# EAGLE schematic parrot_v1 (EAGLE 9.4.1)
CNAME: Parrot Teensy Board; CREVISION: 1.0; DESIGNER: Nathan Villicana-Shaw
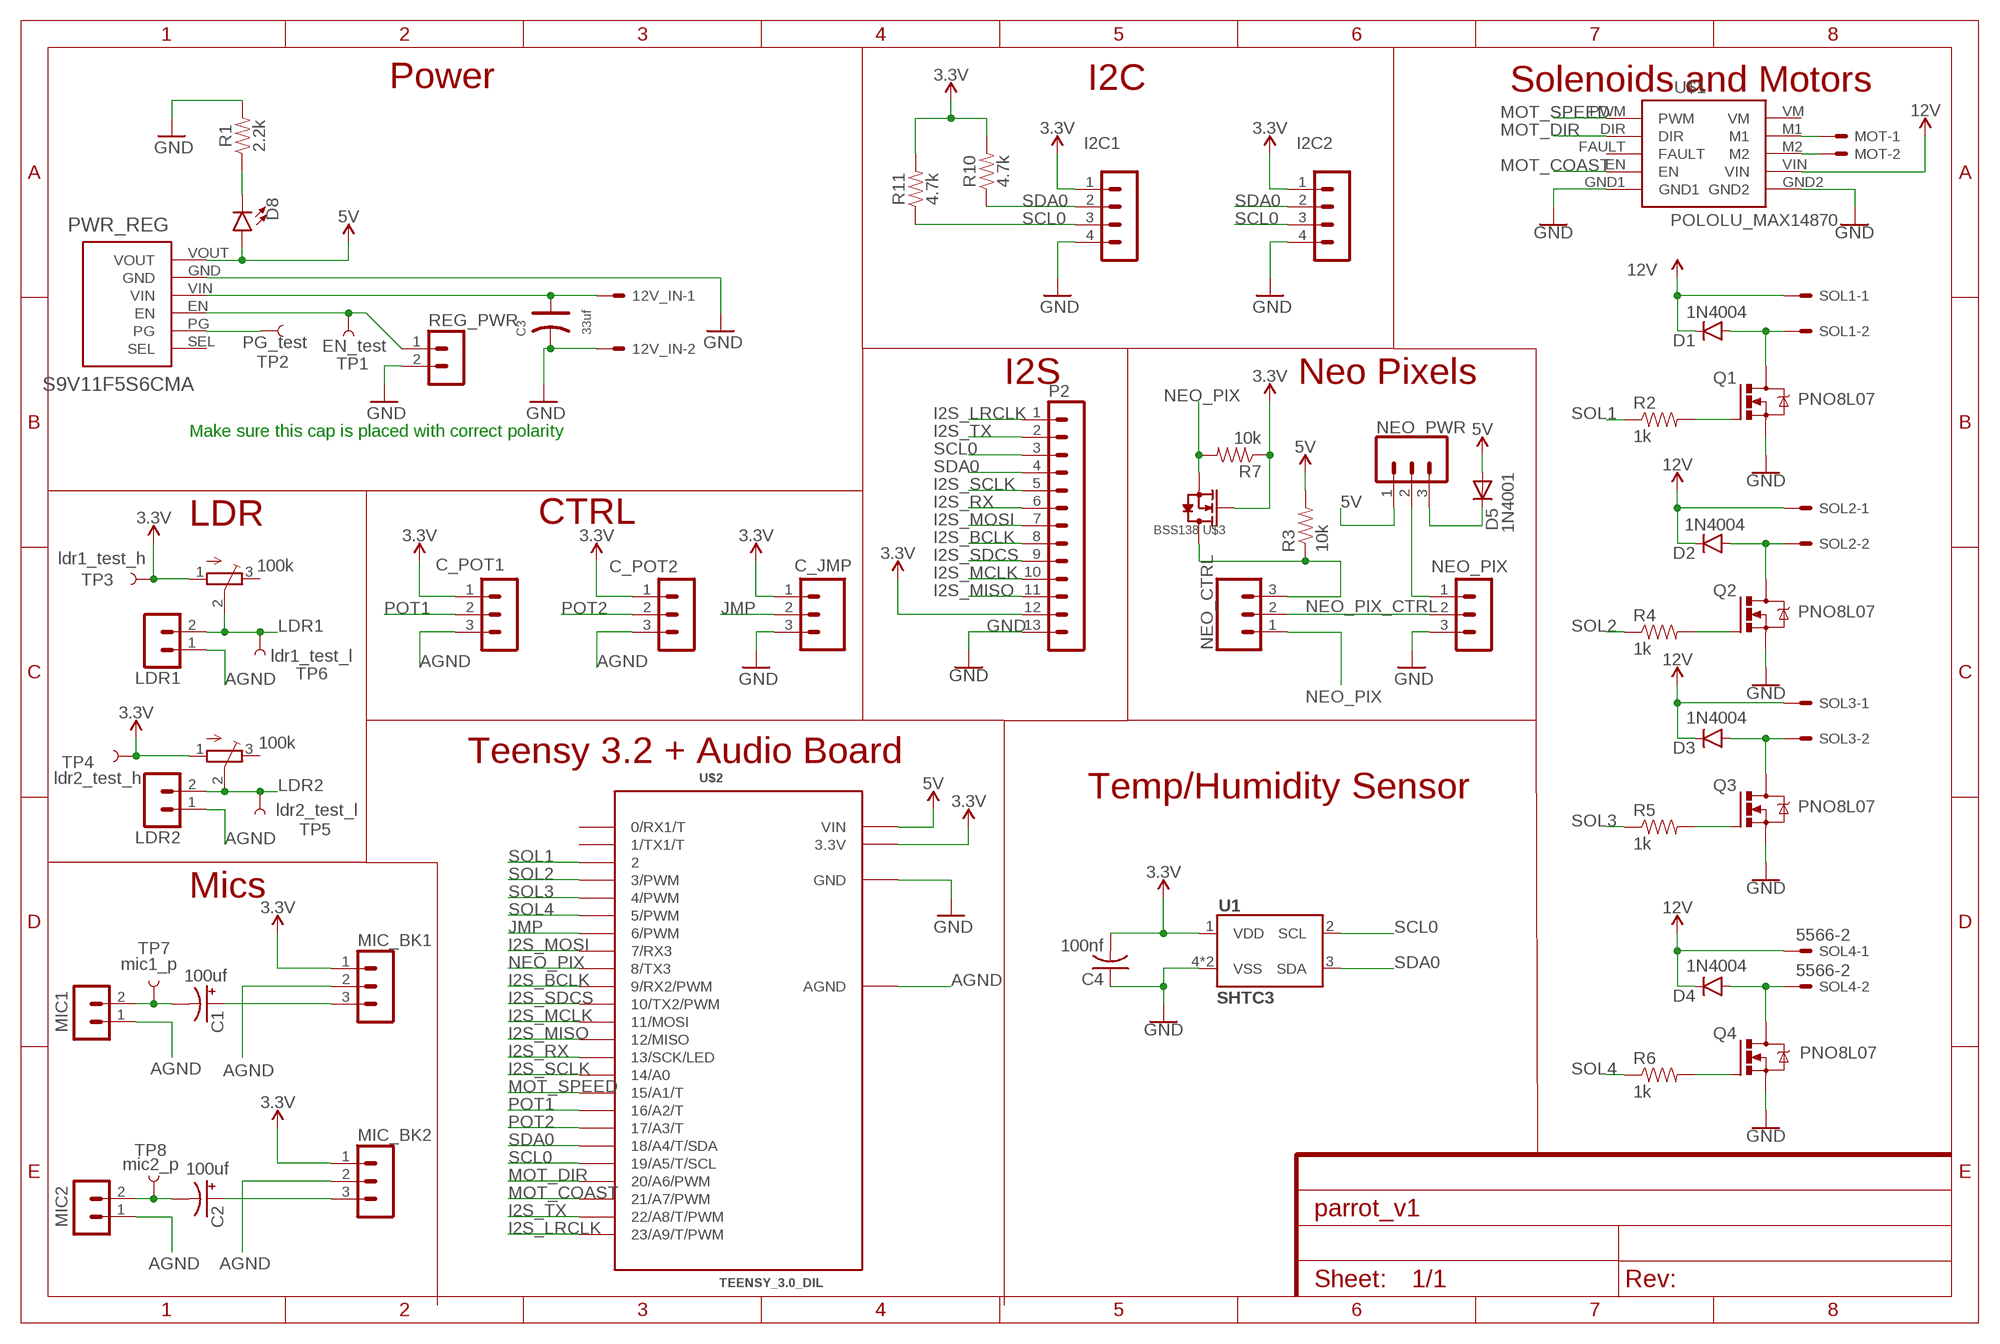
[diagram p0: schematic, sheet 1]

## Parts
12V_IN  5566-2  [5566-2]
C1  100uf  1000UF-RADIAL-5MM-25V-20%  [CPOL-RADIAL-5MM-10MM]
C2  100uf  1000UF-RADIAL-5MM-25V-20%  [CPOL-RADIAL-5MM-10MM]
C3  33uf  DIP-ALUMINUM-47UF-16V(D5-H7MM)  [PC-D5.3MM]
C4  100nf  C-USC2012  [C2012]
C_JMP  CONN_03  [1X03]
C_POT1  B3B-PH-K  [B3B-PH-K]
C_POT2  B3B-PH-K  [B3B-PH-K]
D1  1N4004  DIODEPTH  [DIODE-1N4001]
D2  1N4004  DIODEPTH  [DIODE-1N4001]
D3  1N4004  DIODEPTH  [DIODE-1N4001]
D4  1N4004  DIODEPTH  [DIODE-1N4001]
D5  1N4001  1N4004  [DO41-10]
D8  LED-FKIT-1206  [FKIT-LED-1206]
I2C1  B4B-PH-K  [B4B-PH-K]
I2C2  B4B-PH-K  [B4B-PH-K]
LDR1  B2B-PH-K  [B2B-PH-K]
LDR2  B2B-PH-K  [B2B-PH-K]
MIC1  B2B-PH-K  [B2B-PH-K]
MIC2  B2B-PH-K  [B2B-PH-K]
MIC_BK1  B3B-PH-K  [B3B-PH-K]
MIC_BK2  B3B-PH-K  [B3B-PH-K]
MOT  5566-2  [5566-2]
NEO_CTRL  CONN_03  [1X03]
NEO_PIX  B3B-PH-K  [B3B-PH-K]
NEO_PWR  CONN_03  [1X03]
P2  B13B-PH-K  [B13B-PH-K]
PWR_REG  S9V11F5S6CMA  [S9V11F3S5CMA]
Q1  PNO8L07  IRF540  [TO220BV]
Q2  PNO8L07  IRF540  [TO220BV]
Q3  PNO8L07  IRF540  [TO220BV]
Q4  PNO8L07  IRF540  [TO220BV]
R1  2.2k  2.2OHM-0603-1/10W-5%  [0603]
R2  1k  10KOHM-HORIZ-1/4W-5%  [AXIAL-0.3]
R3  10k  10KOHM-HORIZ-1/4W-5%  [AXIAL-0.3]
R4  1k  10KOHM-HORIZ-1/4W-5%  [AXIAL-0.3]
R5  1k  10KOHM-HORIZ-1/4W-5%  [AXIAL-0.3]
R6  1k  10KOHM-HORIZ-1/4W-5%  [AXIAL-0.3]
R7  10k  10KOHM-HORIZ-1/4W-5%  [AXIAL-0.3]
R10  4.7k  10OHM-HORIZ-1/4W-1%  [AXIAL-0.3]
R11  4.7k  10OHM-HORIZ-1/4W-1%  [AXIAL-0.3]
REG_PWR  B2B-PH-K  [B2B-PH-K]
SOL1  5566-2  [5566-2]
SOL2  5566-2  [5566-2]
SOL3  5566-2  [5566-2]
SOL4  5566-2  [5566-2]
TM1  100k  TRIMPOTTC33X  [TC33X]
TM2  100k  TRIMPOTTC33X  [TC33X]
TP1  EN_test  TEST-POINTTP_15TH_THRU  [TP_15TH]
TP2  PG_test  TEST-POINTTP_15TH_THRU  [TP_15TH]
TP3  ldr1_test_h  TEST-POINTTP_15TH_THRU  [TP_15TH]
TP4  ldr2_test_h  TEST-POINTTP_15TH_THRU  [TP_15TH]
TP5  ldr2_test_l  TEST-POINTTP_15TH_THRU  [TP_15TH]
TP6  ldr1_test_l  TEST-POINTTP_15TH_THRU  [TP_15TH]
TP7  mic1_p  TEST-POINTTP_15TH_THRU  [TP_15TH]
TP8  mic2_p  TEST-POINTTP_15TH_THRU  [TP_15TH]
U1  SHTC3  [SHTC3]
U$1  POLOLU_MAX14870  [POLOLU_MAX14870]
U$2  TEENSY_3.0_DIL  [TEENSY_3.0-3.2&LC_DIL]
U$3  BSS138  [SOT23-3]

## Nets
3.3V [3.3V]: C4.2 C_JMP.1 C_POT1.1 C_POT2.1 I2C1.1 I2C2.1 MIC_BK1.1 MIC_BK2.1 P2.12 R7.P$1 R10.P$2 R11.P$2 TM1.1(A) TM2.1(A) TP3.P$1 TP4.P$1 U1.1(VDD) U$2.3.3V U$3.1(G)
5V: D5.A D8.A NEO_PWR.1 PWR_REG.VOUT R3.P$2 U$2.VIN
12V [12V_IN]: 12V_IN.1 C3.+ D1.C D2.C D3.C D4.C PWR_REG.VIN SOL1.1 SOL2.1 SOL3.1 SOL4.1 U$1.VIN
AGND: C_POT1.3 C_POT2.3 LDR1.1 LDR2.1 MIC1.1 MIC2.1 MIC_BK1.2 MIC_BK2.2 U$2.AGND
GND: 12V_IN.2 C3.- C4.1 C_JMP.3 I2C1.4 I2C2.4 NEO_PIX.3 P2.13 PWR_REG.GND Q1.S Q2.S Q3.S Q4.S R1.2 REG_PWR.2 U1.4(VSS) U1.5(VSS) U$1.GND2 U$2.GND
I2S_BCLK: P2.8 U$2.9(9/RX2/PWM)
I2S_LRCLK: P2.1 U$2.23/A9(23/A9/T/PWM)
I2S_MCLK: P2.10 U$2.11(11/MOSI)
I2S_MISO: P2.11 U$2.12(12/MISO)
I2S_MOSI: P2.7 U$2.7(7/RX3)
I2S_RX: P2.6 U$2.13(13/SCK/LED)
I2S_SCLK: P2.5 U$2.14/A0
I2S_SDCS: P2.9 U$2.10(10/TX2/PWM)
I2S_TX: P2.2 U$2.22/A8(22/A8/T/PWM)
JMP: C_JMP.2 U$2.6(6/PWM)
LDR1: LDR1.2 TM1.2(S) TP6.P$1
LDR2: LDR2.2 TM2.2(S) TP5.P$1
MOT_COAST: U$1.EN U$2.21/A7(21/A7/PWM)
MOT_DIR: U$1.DIR U$2.20/A6(20/A6/PWM)
MOT_SPEED: U$1.PWM U$2.15/A1(15/A1/T)
N$1: D8.C R1.1
N$2: C1.- MIC1.2 TP7.P$1
N$3: PWR_REG.PG TP2.P$1
N$4: C2.+ MIC_BK2.3
N$5: Q2.G R4.P$2
N$6: C1.+ MIC_BK1.3
N$7: C2.- MIC2.2 TP8.P$1
N$8: D2.A Q2.D SOL2.2
N$9 [3.3V]: NEO_PIX.1 NEO_PWR.2
N$10: PWR_REG.EN REG_PWR.1 TP1.P$1
N$11: Q3.G R5.P$2
N$12: D3.A Q3.D SOL3.2
N$13: Q4.G R6.P$2
N$14: D4.A Q4.D SOL4.2
N$15: U$1.GND1 ; supply symbol labelled GND
N$16: D5.C NEO_PWR.3
N$17: NEO_CTRL.3 R3.P$1 U$3.3(D)
N$24: Q1.G R2.P$2
N$25: D1.A Q1.D SOL1.2
N$30: MOT.2 U$1.M2
N$31: MOT.1 U$1.M1
NEO_PIX: NEO_CTRL.1 R7.P$2 U$2.8(8/TX3) U$3.2(S)
NEO_PIX_CTRL: NEO_CTRL.2 NEO_PIX.2
POT1: C_POT1.2 U$2.16/A2(16/A2/T)
POT2: C_POT2.2 U$2.17/A3(17/A3/T)
SCL0: I2C1.3 I2C2.3 P2.3 R11.P$1 U1.2(SCL) U$2.19/A5(19/A5/T/SCL)
SDA0: I2C1.2 I2C2.2 P2.4 R10.P$1 U1.3(SDA) U$2.18/A4(18/A4/T/SDA)
SOL1: R2.P$1 U$2.2
SOL2: R4.P$1 U$2.3(3/PWM)
SOL3: R5.P$1 U$2.4(4/PWM)
SOL4: R6.P$1 U$2.5(5/PWM)
Unconnected: PWR_REG.SEL TM1.3(E) TM2.3(E) U$1.FAULT U$1.VM U$2.0(0/RX1/T) U$2.1(1/TX1/T)

## Notes on the sheet
- Solenoids and Motors
- Power | I2C
- I2S | Neo Pixels
- Make sure this cap is placed with correct polarity
- LDR | CTRL
- Teensy 3.2 + Audio Board
- Temp/Humidity Sensor
- Mics

## Library data of the parts
12V_IN MOT SOL1-SOL4 = con-molex:5566-2: Mini FIT connector 2 pol Source: http://www.molex.com; MF: MOLEX; OC_FARNELL: 1822072; OC_NEWARK: unknown
C1 C2 = SparkFun-Capacitors:1000UF: 1,000µF/1mF ceramic capacitors A capacitor is a passive two-terminal electrical component used to store electrical energy temporarily in an electric field. CAP-08070; PROD_ID: CAP-09538; VALUE: 1mF
C3 = Seeed-Capacitor:DIP-ALUMINUM-47UF-16V(D5-H7MM): 302030033; MPN: KS 100uF/16V; VALUE: 100uf
C4 = adafruit:C-US: CAPACITOR, American symbol
C_JMP NEO_CTRL NEO_PWR = SparkFun-Connectors:CONN_03: Multi connection point. Often used as Generic Header-pin footprint for 0.1 inch spaced/style header connections On any of the 0.1 inch spaced packages, you can populate with these: Break Away Headers - Straight <https://www.sparkfun.com/products/116> (PRT-00116) Break Away Male Headers - Right Angle <https://www.sparkfun.com/products/553> (PRT-00553) Female Headers <https://www.sparkfun.com/products/115> (PRT-00115) Break Away Headers - Machine Pin <https://www.sparkfun.com/products/117> (PRT-00117) Break Away Female Headers - Swiss Machine Pin <https://www.sparkfun.com/products/743> (PRT-00743) Stackable Header - 3 Pin (Female, 0.1") <https://www.sparkfun.com/products/13875> (PRT-13875) For SCREWTERMINALS and SPRING TERMINALS visit here: Screw Terimnals on SparkFun.com <https://www.sparkfun.com/search/results?term=Screw+Terminals> (5mm/3.5mm/2.54mm spacing) This device is also useful as a general connection point to wire up your design to another part of your project. Our various solder wires solder well into these plated through hole pads. Hook-Up Wire - Assortment (Stranded, 22 AWG) <https://www.sparkfun.com/products/11375> (PRT-11375) Hook-Up Wire - Assortment (Solid Core, 22 AWG) <https://www.sparkfun.com/products/11367> (PRT-11367) View the entire wire category on our website here <https://www.sparkfun.com/categories/141> Special notes: Molex polarized connector foot print use with SKU : PRT-08232 with associated crimp pins and housings.
C_POT1 C_POT2 MIC_BK1 MIC_BK2 NEO_PIX = con-jst-ph:B3B-PH-K: HEADER
D1-D4 = SparkFun-DiscreteSemi:DIODE: Diode These are standard reverse protection diodes and small signal diodes. SMA package can handle up to about 1A. SOD-323 can handle about 200mA. What the SOD-323 package when ordering, there are some mfgs out there that are 5-pin packages.
D5 = adafruit:1N4004: DIODE General purpose 1N400x type rectifier (With bigger pads) http://www.ladyada.net/library/pcb/eaglelibrary.html
D8 = SparkFun-LED:LED: LED (Generic) Standard schematic elements and footprints for 5mm, 3mm, 1206, and 0603 sized LEDs. Generic LEDs with no color specified.
I2C1 I2C2 = con-jst-ph:B4B-PH-K: HEADER
LDR1 LDR2 MIC1 MIC2 REG_PWR = con-jst-ph:B2B-PH-K: HEADER
P2 = con-jst-ph:B13B-PH-K: HEADER
PWR_REG = nathans-custom-parts:S9V11F5S6CMA
Q1-Q4 = transistor-power:IRF540: HEXFET Power MOSFET
R1 = SparkFun-Resistors:2.2OHM: 2.2Ω resistor A resistor is a passive two-terminal electrical component that implements electrical resistance as a circuit element. Resistors act to reduce current flow, and, at the same time, act to lower voltage levels within circuits. - Wikipedia; PROD_ID: RES-07823; VALUE: 2.2
R2 R4-R6 = SparkFun-Resistors:10KOHM: 10kΩ resistor A resistor is a passive two-terminal electrical component that implements electrical resistance as a circuit element. Resistors act to reduce current flow, and, at the same time, act to lower voltage levels within circuits. - Wikipedia; PROD_ID: RES-09435; VALUE: 10k
R3 R7 = SparkFun-Resistors:10KOHM: 10kΩ resistor A resistor is a passive two-terminal electrical component that implements electrical resistance as a circuit element. Resistors act to reduce current flow, and, at the same time, act to lower voltage levels within circuits. - Wikipedia; PROD_ID: RES-09435
R10 R11 = SparkFun-Resistors:10OHM: 10Ω resistor A resistor is a passive two-terminal electrical component that implements electrical resistance as a circuit element. Resistors act to reduce current flow, and, at the same time, act to lower voltage levels within circuits. - Wikipedia; PROD_ID: RES-12180; VALUE: 10
TM1 TM2 = adafruit:TRIMPOT: SMT trimmer potentiometer part number TC33X http://www.ladyada.net/library/eagle
TP1-TP8 = SparkFun-Connectors:TEST-POINT: SparkFun Test Points Bare copper test points for troubleshooting or In-Circuit-Testing. These are used by our Production team for verifying production board runs using pogo-pins on test beds. SparkFun Products: SparkFun LSM9DS1 Breakout <https://www.sparkfun.com/products/13284> SparkFun PSOC <https://www.sparkfun.com/products/13714> SparkFun Load Cell Amplifier <https://www.sparkfun.com/products/13879>
U1 = SHTC3:SHTC3
U$1 = nathans-custom-parts:POLOLU_MAX14870
U$2 = teensy_3_and_LC:TEENSY_3.0_DIL: TEENSY 3.0 in a classic breadboard layout - pins between the two outer rows.
U$3 = nathans-custom-parts:BSS138

## Net classes
0 default: width 0.152 mm, drill 0.508 mm, clearance 0.203 mm
1 12V_IN: width 1.27 mm, drill 0.762 mm, clearance 0.305 mm
2 3.3V: width 0.203 mm, drill 0.508 mm, clearance 0.254 mm
3 5V: width 0.406 mm, drill 0.508 mm, clearance 0.381 mm